# EAGLE schematic main (EAGLE 9.6.2)
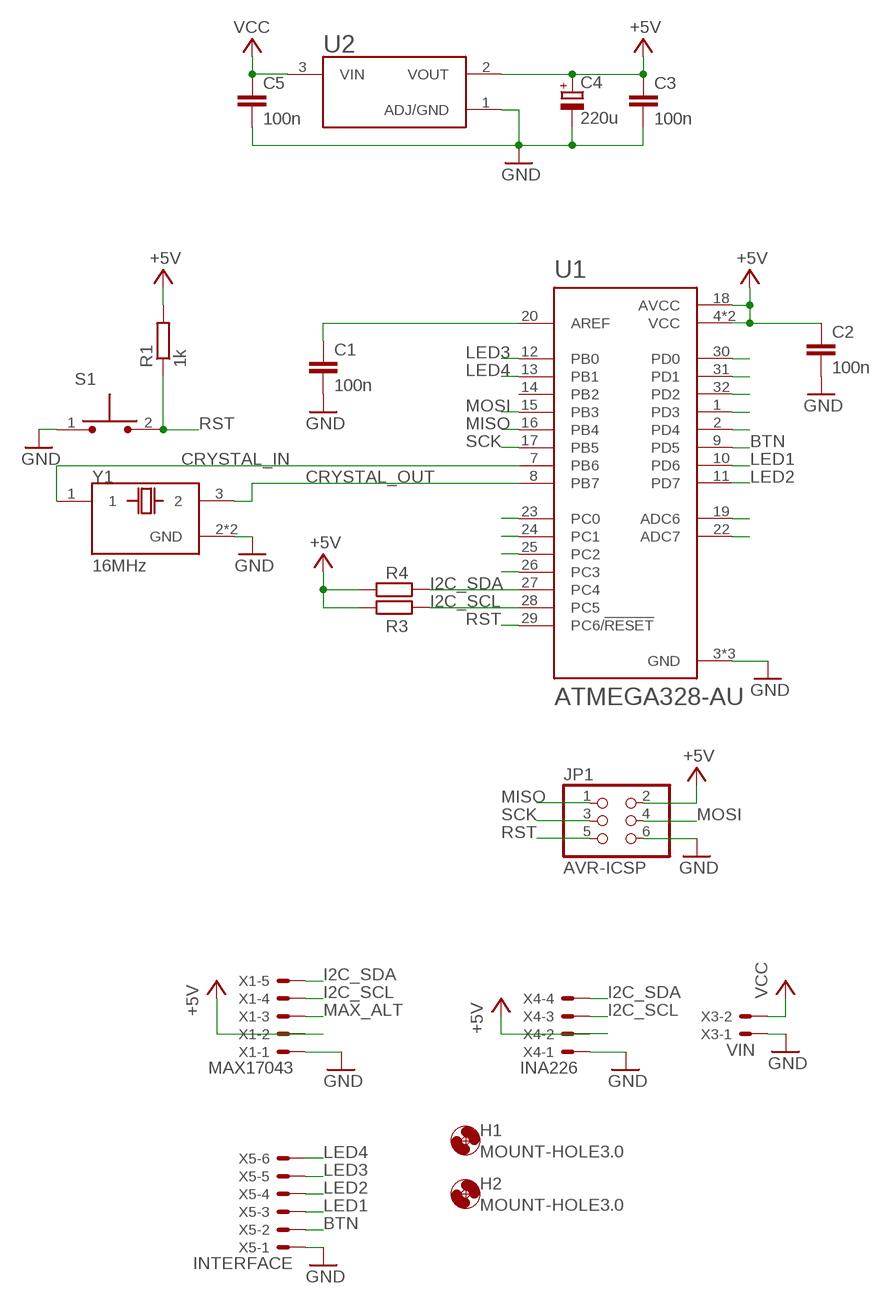
[diagram p0: schematic, sheet 1]

## Parts
C1  100n  C-EUC0805  [C0805]
C2  100n  C-EUC0805  [C0805]
C3  100n  C-EUC0805  [C0805]
C4  220u  CPOL-EU153CLV-0605  [153CLV-0605]
C5  100n  C-EUC0805  [C0805]
H1  MOUNT-HOLE3.0  [3,0]
H2  MOUNT-HOLE3.0  [3,0]
JP1  AVR-ICSP  PINHD-2X3  [2X03]
R1  1k  R-EU_R0805  [R0805]
R3  R-EU_R0805  [R0805]
R4  R-EU_R0805  [R0805]
S1  TL1015AF160QG  [SW_TL1015AF160QG]
U1  ATMEGA328-AU  [QFP80P900X900X120-32N]
U2  AMS1117-3.3  [SOT229P700X180-4N]
X1  MAX17043  JST-XH-05-PIN-LONG-PAD  [JST-XH-05-PACKAGE-LONG-PAD]
X3  VIN  JST-XH-02-PIN-LONG-PAD  [JST-XH-02-PACKAGE-LONG-PAD]
X4  INA226  JST-XH-04-PIN-LONG-PAD  [JST-XH-04-PACKAGE-LONG-PAD]
X5  INTERFACE  JST-XH-06-PIN-LONG-PAD  [JST-XH-06-PACKAGE-LONG-PAD]
Y1  16MHz  TSX-3225_16.0000MF18X-AC3  [XTAL_TSX-3225_16.0000MF18X-AC3]

## Nets
+5V: C2.1 C3.1 C4.+ JP1.2 R1.2 R3.1 R4.1 U1.4(VCC) U1.6(VCC) U1.18(AVCC) U2.2(VOUT) X1.2 X4.2
BTN: U1.9(PD5) X5.2
CRYSTAL_IN: U1.7(PB6) Y1.1
CRYSTAL_OUT: U1.8(PB7) Y1.3
GND: C1.2 C2.2 C3.2 C4.- C5.2 JP1.6 S1.1 U1.3(GND) U1.5(GND) U1.21(GND) U2.1(ADJ/GND) X1.1 X3.1 X4.1 X5.1 Y1.2(GND) Y1.4(GND)
I2C_SCL: R3.2 U1.28(PC5) X1.4 X4.3
I2C_SDA: R4.2 U1.27(PC4) X1.5 X4.4
LED1: U1.10(PD6) X5.3
LED2: U1.11(PD7) X5.4
LED3: U1.12(PB0) X5.5
LED4: U1.13(PB1) X5.6
MAX_ALT: U1.32(PD2) X1.3
MISO: JP1.1 U1.16(PB4)
MOSI: JP1.4 U1.15(PB3)
N$1: U1.2(PD4)
N$2: C1.1 U1.20(AREF)
N$4: U1.30(PD0)
N$11: U1.23(PC0)
N$12: U1.24(PC1)
N$13: U1.25(PC2)
N$14: U1.26(PC3)
N$15: U1.1(PD3)
N$18: U1.22(ADC7)
N$19: U1.19(ADC6)
N$26: U1.31(PD1)
RST: JP1.5 R1.1 S1.2 U1.29(PC6/!RESET)
SCK: JP1.3 U1.17(PB5)
VCC: C5.1 U2.3(VIN) X3.2
Unconnected: U1.14(PB2)

## Library data of the parts
C1-C3 C5 = rcl:C-EU: CAPACITOR, European symbol; SPICEPREFIX: C
C4 = rcl:CPOL-EU: POLARIZED CAPACITOR, European symbol; SPICEPREFIX: C
H1 H2 = holes:MOUNT-HOLE: MOUNTING HOLE with drill center marker
JP1 = pinhead:PINHD-2X3: PIN HEADER
R1 R3 R4 = rcl:R-EU_: RESISTOR, European symbol; SPICEPREFIX: R
S1 = TL1015AF160QG:TL1015AF160QG: Tactile Switch SPST-NO Top Actuated Surface Mount Check prices <https://pricing.snapeda.com/parts/TL1015AF160QG/E-Switch/view-part?ref=eda>; AVAILABILITY: In Stock; DESCRIPTION: Tactile Switch SPST-NO Top Actuated Surface Mount; MF: E-Switch; MP: TL1015AF160QG; PACKAGE: SOIC-14 E-Switch; PRICE: None; PURCHASE-URL: https://pricing.snapeda.com/search/part/TL1015AF160QG/?ref=eda
U1 = ATMEGA328-AU:ATMEGA328-AU: ATmega Series 20 MHz 32 KB Flash 2 KB SRAM 8-Bit Microcontroller - TQFP-32 Check availability <https://pricing.snapeda.com/parts/ATMEGA328-AU/Microchip/view-part?ref=eda>; AVAILABILITY: Not in stock; DESCRIPTION: AVR AVR® ATmega Microcontroller IC 8-Bit 20MHz 32KB (16K x 16) FLASH 32-TQFP (7x7); MF: Microchip; MP: ATMEGA328-AU; PACKAGE: TQFP-32 Microchip; PRICE: None
U2 = AMS1117-3.3:AMS1117-3.3: Sot223/Pkg 1-Amp 3.3-Volt Low Drop Out Voltage Regulatator; AVAILABILITY: Unavailable; DESCRIPTION: Sot223/Pkg 1-Amp 3.3-Volt Low Drop Out Voltage Regulatator; MF: Advanced Monolithic Systems; MP: AMS1117-3.3; PACKAGE: SOT-89 ams; PRICE: None
X1 = Rembrandt Electronics - JST XH Connectors v1-0-2-2-2-2:JST-XH-05-PIN: JST XH Connector 2 Pin Wire to board connector. Pitch: 2,54 mm, (0.100") Number of pins: 5 Created by Rembrandt Electronics www.rembrandtelectronics.com
X3 = Rembrandt Electronics - JST XH Connectors v1-0-2-2-2-2:JST-XH-02-PIN: JST XH Connector 2 Pin Wire to board connector. Pitch: 2,54 mm, (0.100") Number of pins: 2 Created by Rembrandt Electronics www.rembrandtelectronics.com
X4 = Rembrandt Electronics - JST XH Connectors v1-0-2-2-2-2:JST-XH-04-PIN: JST XH Connector 2 Pin Wire to board connector. Pitch: 2,54 mm, (0.100") Number of pins: 4 Created by Rembrandt Electronics www.rembrandtelectronics.com
X5 = Rembrandt Electronics - JST XH Connectors v1-0-2-2-2-2:JST-XH-06-PIN: JST XH Connector 2 Pin Wire to board connector. Pitch: 2,54 mm, (0.100") Number of pins: 6 Created by Rembrandt Electronics www.rembrandtelectronics.com
Y1 = TSX-3225_16.0000MF18X-AC3:TSX-3225_16.0000MF18X-AC3: SMD Crystal 16MHz-9pF-10ppm-60R; Check prices <https://pricing.snapeda.com/parts/TSX-3225%2016.0000MF18X-AC3/EPSON/view-part?ref=eda>; AVAILABILITY: Warning; DESCRIPTION: 16MHz ±10ppm Crystal 9pF 60 Ohms 4-SMD, No Lead; MF: EPSON; MP: TSX-3225 16.0000MF18X-AC3; PACKAGE: SMD-4 EPSON; PRICE: None; PURCHASE-URL: https://pricing.snapeda.com/search/part/TSX-3225 16.0000MF18X-AC3/?ref=eda